# EAGLE design untitled (EAGLE 7.7.0)
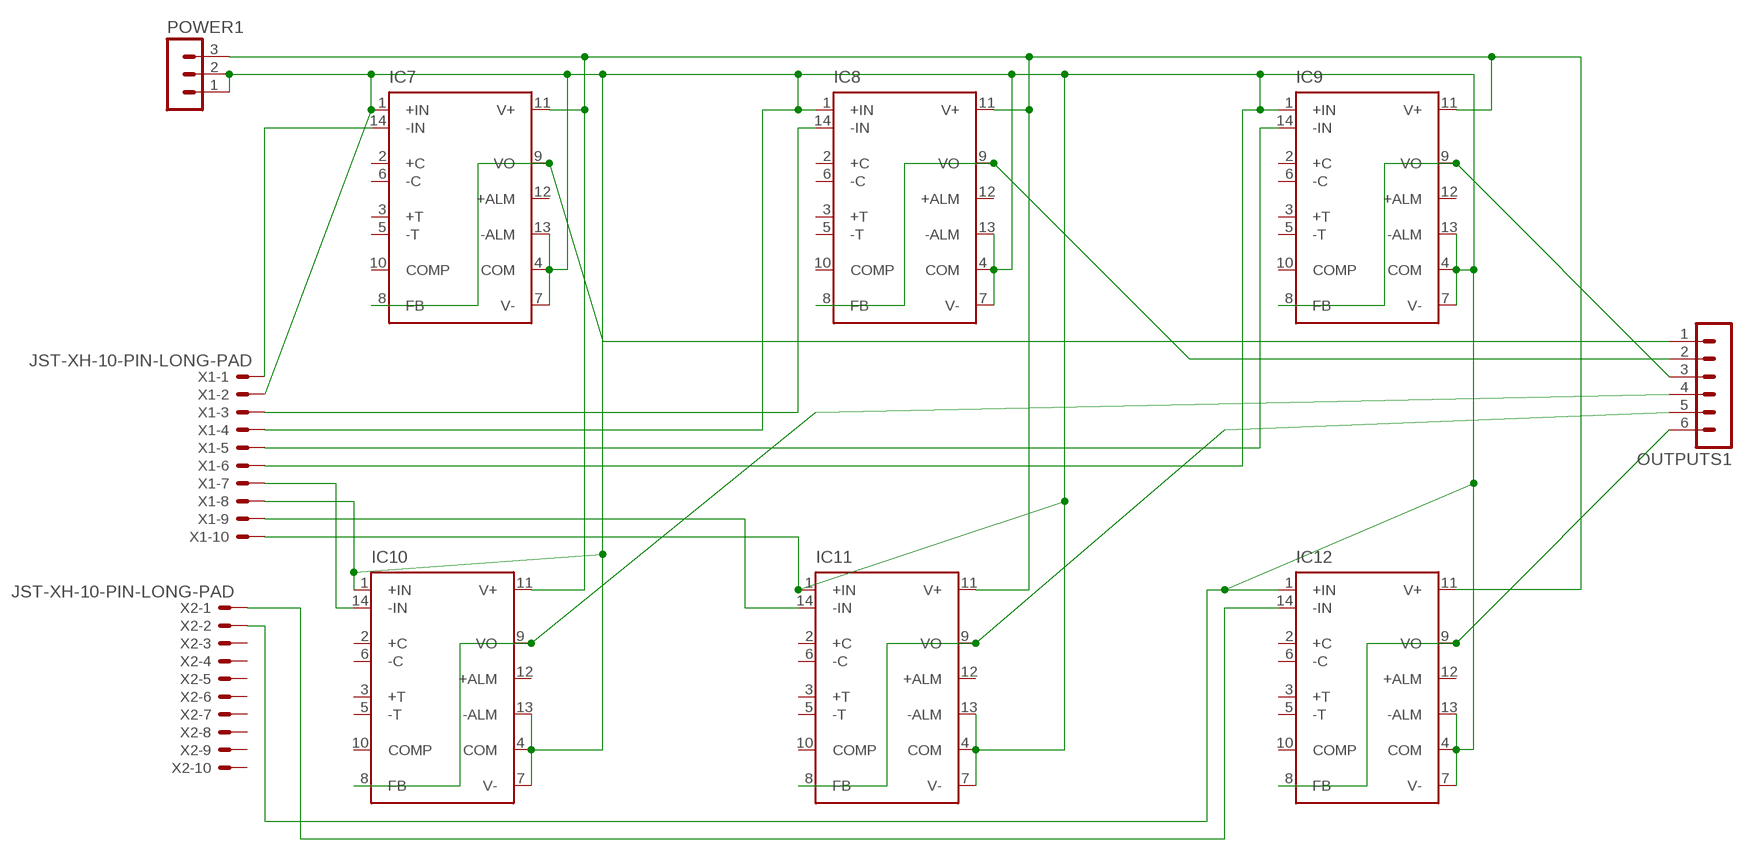
[diagram p0: schematic, sheet 1]

## Parts
IC7  AD594  [DIL14]
IC8  AD594  [DIL14]
IC9  AD594  [DIL14]
IC10  AD594  [DIL14]
IC11  AD594  [DIL14]
IC12  AD594  [DIL14]
OUTPUTS1  MA06-1  [MA06-1]
POWER1  MA03-1  [MA03-1]
X1  JST-XH-10-PIN-LONG-PAD  [JST-XH-10-PACKAGE-LONG-PAD]
X2  JST-XH-10-PIN-LONG-PAD  [JST-XH-10-PACKAGE-LONG-PAD]

## Nets
N$2: IC7.14(-IN) X1.1
N$4: IC8.14(-IN) X1.3
N$6: IC9.14(-IN) X1.5
N$7: IC7.1(+IN) IC7.4(COM) IC7.7(V-) IC7.13(-ALM) IC8.1(+IN) IC8.4(COM) IC8.7(V-) IC8.13(-ALM) IC9.1(+IN) IC9.4(COM) IC9.7(V-) IC9.13(-ALM) IC10.1(+IN) IC10.4(COM) IC10.7(V-) IC10.13(-ALM) IC11.1(+IN) IC11.4(COM) IC11.7(V-) IC11.13(-ALM) IC12.1(+IN) IC12.4(COM) IC12.7(V-) IC12.13(-ALM) POWER1.1 POWER1.2 X1.2 X1.4 X1.6 X1.8 X1.10 X2.2
N$8: IC10.14(-IN) X1.7
N$9: IC11.14(-IN) X1.9
N$11: IC12.14(-IN) X2.1
N$14: IC7.8(FB) IC7.9(VO) OUTPUTS1.1
N$15: IC8.8(FB) IC8.9(VO) OUTPUTS1.2
N$17: IC9.8(FB) IC9.9(VO) OUTPUTS1.3
N$18: IC10.8(FB) IC10.9(VO) OUTPUTS1.4
N$25: IC11.8(FB) IC11.9(VO) OUTPUTS1.5
N$26: IC12.8(FB) IC12.9(VO) OUTPUTS1.6
N$27: IC7.11(V+) IC8.11(V+) IC9.11(V+) IC10.11(V+) IC11.11(V+) IC12.11(V+) POWER1.3
Unconnected: IC7.2(+C) IC7.3(+T) IC7.5(-T) IC7.6(-C) IC7.10(COMP) IC7.12(+ALM) IC8.2(+C) IC8.3(+T) IC8.5(-T) IC8.6(-C) IC8.10(COMP) IC8.12(+ALM) IC9.2(+C) IC9.3(+T) IC9.5(-T) IC9.6(-C) IC9.10(COMP) IC9.12(+ALM) IC10.2(+C) IC10.3(+T) IC10.5(-T) IC10.6(-C) IC10.10(COMP) IC10.12(+ALM) IC11.2(+C) IC11.3(+T) IC11.5(-T) IC11.6(-C) IC11.10(COMP) IC11.12(+ALM) IC12.2(+C) IC12.3(+T) IC12.5(-T) IC12.6(-C) IC12.10(COMP) IC12.12(+ALM) X2.3 X2.4 X2.5 X2.6 X2.7 X2.8 X2.9 X2.10

## Library data of the parts
IC7-IC12 = analog-devices:AD594: ANALOG DEVICES; MF: ALTERA CORPORATION; MPN: AD594AQ; OC_FARNELL: 409182; OC_NEWARK: 05F7088
OUTPUTS1 = con-lstb:MA06-1: PIN HEADER; OC_FARNELL: unknown; OC_NEWARK: unknown
POWER1 = con-lstb:MA03-1: PIN HEADER; OC_FARNELL: unknown; OC_NEWARK: unknown
X1 X2 = Rembrandt Electronics - JST XH Connectors v1-0:JST-XH-10-PIN: JST XH Connector 2 Pin Wire to board connector. Pitch: 2,54 mm, (0.100") Number of pins: 10 Created by Rembrandt Electronics www.rembrandtelectronics.com

## Board
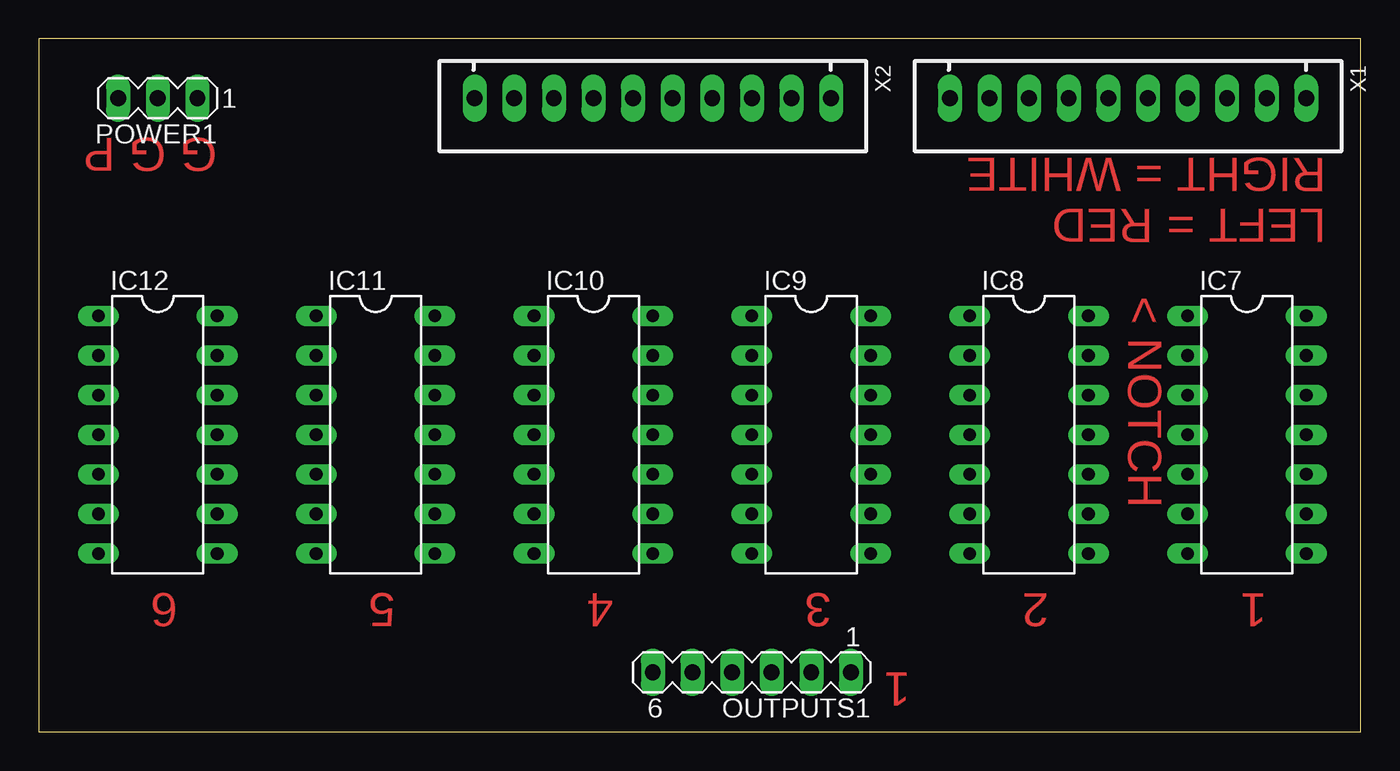
[diagram p1: board, top side]
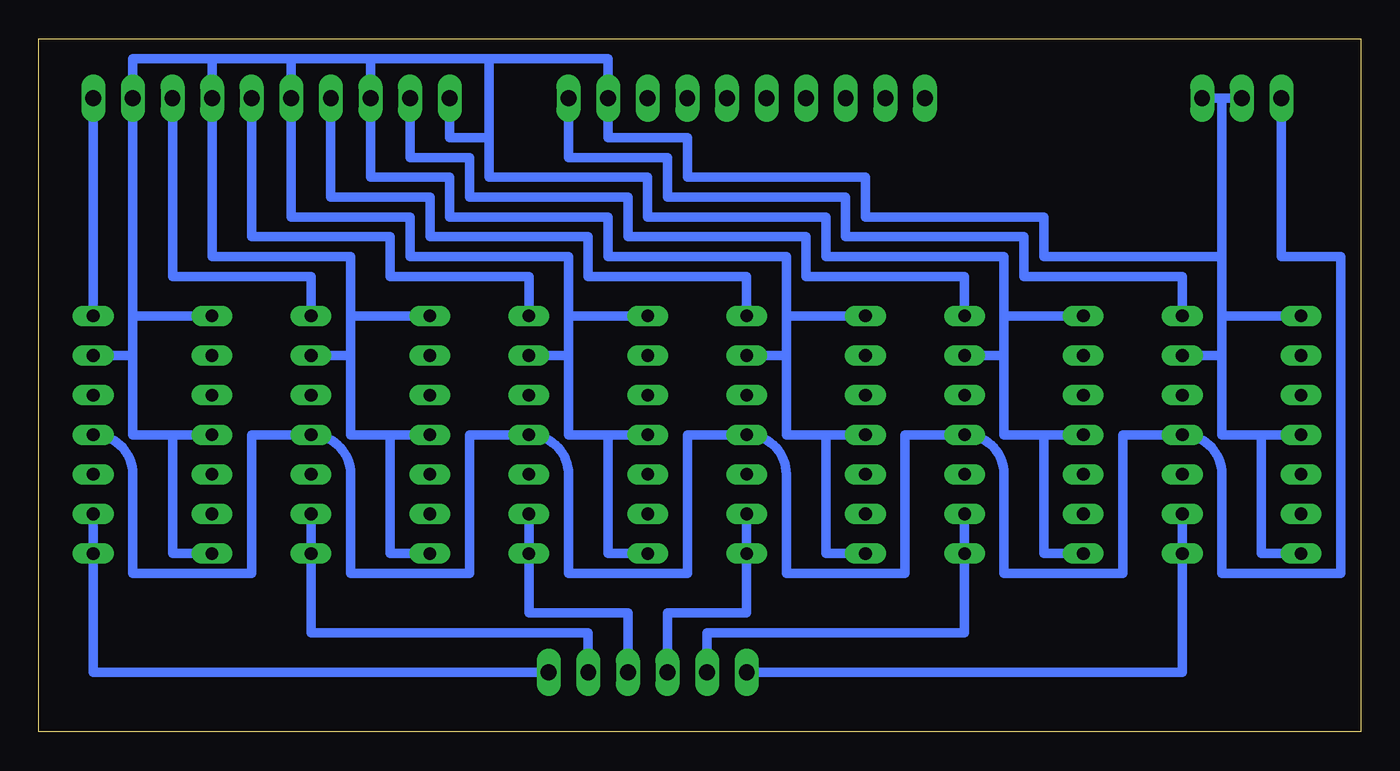
[diagram p2: board, bottom side, seen from below]

Size 84.76 x 44.44 mm. Coordinates in mm from the lower left corner, seen from the top.
Outline: 0,0 84.76,0 84.76,44.44 0,44.44 0,0
Copper layers (1*16): Top 0.035mm / dielectric 1.5mm / Bottom 0.035mm
Design rules "default": minimum track width 10mil, minimum drill 24mil, track to track 8mil, track to pad 8mil, pad to pad 8mil, via to via 8mil, smd to smd 8mil, copper to edge 40mil, drill to drill 8mil, minimum pad ring 10mil, minimum via ring 8mil, stop-mask expansion 4mil, vias tented up to drill 0mil, thermal gap 10mil

### Footprints (pad centres in the part's own frame; a part is rotated, then mirrored left to right if it is on the bottom)
DIL14 = drill 0.813 long: 1 -7.62,-3.81; 2 -5.08,-3.81; 3 -2.54,-3.81; 4 0,-3.81; 5 2.54,-3.81; 6 5.08,-3.81; 7 7.62,-3.81; 8 7.62,3.81; 9 5.08,3.81; 10 2.54,3.81; 11 0,3.81; 12 -2.54,3.81; 13 -5.08,3.81; 14 -7.62,3.81
MA06-1 = drill 1.016 long: 1 -6.35,0; 2 -3.81,0; 3 -1.27,0; 4 1.27,0; 5 3.81,0; 6 6.35,0
MA03-1 = drill 1.016 long: 1 -2.54,0; 2 0,0; 3 2.54,0
JST-XH-10-PACKAGE-LONG-PAD = drill 1.016 long: 1 -11.43,0; 2 -8.89,0; 3 -6.35,0; 4 -3.81,0; 5 -1.27,0; 6 1.27,0; 7 3.81,0; 8 6.35,0; 9 8.89,0; 10 11.43,0

### Placement (x,y rotation side)
IC7  77.47,19.05 270 top
IC8  63.5,19.05 270 top
IC9  49.53,19.05 270 top
IC10  35.56,19.05 270 top
IC11  21.59,19.05 270 top
IC12  7.62,19.05 270 top
OUTPUTS1  45.72,3.81 180 top
POWER1  7.62,40.64 180 top
X1  69.85,40.64 180 top
X2  39.37,40.64 180 top

### Tracks (layer width: path | path; a pad name or v marks a point on that pad's centre or on a via)
N$2
  Bottom 0.61: X1.1 IC7.14
N$4
  Bottom 0.61: X1.3 76.2,29.21 67.31,29.21 IC8.14
N$6
  Bottom 0.61: X1.5 71.12,31.75 62.23,31.75 62.23,29.21 53.34,29.21 IC9.14
N$7
  Bottom 0.61: 78.74,26.67 X1.2 78.74,43.18 73.66,43.18 | 78.74,26.67 78.74,24.13 | 78.74,24.13 IC7.13 | 64.77,26.67 64.77,30.48 73.66,30.48 X1.4 73.66,43.18 | 64.77,26.67 IC8.1 | 50.8,26.67 50.8,30.48 60.96,30.48 60.96,33.02 68.58,33.02 X1.6 68.58,43.18 | 50.8,26.67 IC9.1 | 36.83,26.67 36.83,30.48 48.26,30.48 48.26,33.02 58.42,33.02 58.42,35.56 63.5,35.56 X1.8 63.5,43.18 | 36.83,26.67 IC10.1 | X1.10 58.42,38.1 55.88,38.1 | 55.88,38.1 55.88,35.56 45.72,35.56 45.72,33.02 34.29,33.02 34.29,30.48 22.86,30.48 22.86,26.67 | 22.86,26.67 IC11.1 | 8.89,30.48 20.32,30.48 20.32,33.02 31.75,33.02 31.75,35.56 43.18,35.56 43.18,38.1 48.26,38.1 X2.2 48.26,43.18 55.88,43.18 | 8.89,30.48 8.89,26.67 | 8.89,26.67 IC12.1 | 8.89,26.67 8.89,24.13 | 8.89,24.13 IC12.13 | 22.86,26.67 22.86,24.13 | 22.86,24.13 IC11.13 | 36.83,26.67 36.83,24.13 | 36.83,24.13 IC10.13 | 50.8,26.67 50.8,24.13 | 50.8,24.13 IC9.13 | 64.77,26.67 64.77,24.13 | 64.77,24.13 IC8.13 | IC12.7 6.35,11.43 6.35,19.05 | 6.35,19.05 IC12.4 | IC11.7 20.32,11.43 20.32,19.05 | 20.32,19.05 IC11.4 | IC10.7 34.29,11.43 34.29,19.05 | 34.29,19.05 IC10.4 | IC9.7 48.26,11.43 48.26,19.05 | 48.26,19.05 IC9.4 | IC8.7 62.23,11.43 62.23,19.05 | 62.23,19.05 IC8.4 | IC7.7 76.2,11.43 76.2,19.05 | 76.2,19.05 IC7.4 | 78.74,24.13 78.74,19.05 76.2,19.05 | 64.77,24.13 64.77,19.05 62.23,19.05 | 6.35,19.05 8.89,19.05 8.89,24.13 | 20.32,19.05 22.86,19.05 22.86,24.13 | 34.29,19.05 36.83,19.05 36.83,24.13 | 48.26,19.05 50.8,19.05 50.8,24.13 | POWER1.1 POWER1.2 8.89,40.64 8.89,30.48 | 55.88,38.1 55.88,43.18 | 68.58,43.18 63.5,43.18 | 63.5,43.18 55.88,43.18 | 73.66,43.18 68.58,43.18 | IC7.1 78.74,26.67
N$8
  Bottom 0.61: X1.7 66.04,34.29 59.69,34.29 59.69,31.75 49.53,31.75 49.53,29.21 39.37,29.21 IC10.14
N$9
  Bottom 0.61: X1.9 60.96,36.83 57.15,36.83 57.15,34.29 46.99,34.29 46.99,31.75 35.56,31.75 35.56,29.21 25.4,29.21 IC11.14
N$11
  Bottom 0.61: X2.1 50.8,36.83 44.45,36.83 44.45,34.29 33.02,34.29 33.02,31.75 21.59,31.75 21.59,29.21 11.43,29.21 IC12.14
N$14
  Bottom 0.61: IC7.9 IC7.8 81.28,3.81 OUTPUTS1.1
N$15
  Bottom 0.61: IC8.9 IC8.8 67.31,6.35 49.53,6.35 OUTPUTS1.2
N$17
  Bottom 0.61: IC9.9 IC9.8 53.34,7.62 46.99,7.62 OUTPUTS1.3
N$18
  Bottom 0.61: IC10.9 IC10.8 39.37,7.62 44.45,7.62 OUTPUTS1.4
N$25
  Bottom 0.61: IC11.8 IC11.9 25.4,6.35 41.91,6.35 OUTPUTS1.5
N$26
  Bottom 0.61: IC12.9 IC12.8 11.43,3.81 OUTPUTS1.6
N$27
  Bottom 0.61: IC7.11 arc90 78.74,16.51 78.74,10.16 71.12,10.16 71.12,19.05 IC8.11 arc90 64.77,16.51 64.77,10.16 57.15,10.16 57.15,19.05 IC9.11 arc90 50.8,16.51 50.8,10.16 43.18,10.16 43.18,19.05 IC10.11 arc90 36.83,16.51 36.83,10.16 29.21,10.16 29.21,19.05 IC11.11 arc90 22.86,16.51 22.86,10.16 15.24,10.16 15.24,19.05 IC12.11 arc90 8.89,16.51 8.89,10.16 1.27,10.16 1.27,30.48 5.08,30.48 POWER1.3

### Text on the board
Top: G G P | LEFT = RED / RIGHT = WHITE | < NOTCH | 6 | 5 | 4 | 3 | 2 | 1 | 1